# Altium schematic sheet LC BigOne - 5.3A MOSFET for TLC5940 3.SchDoc: DBL TLC5940 driver for High load - 5.3A MOSFET
size A4; Revision: 0; SheetNumber: 2; SheetTotal: 2; Version: 1.0; Variant: 5.3 A MOSFET; Modification: Mod; Project: Light Control
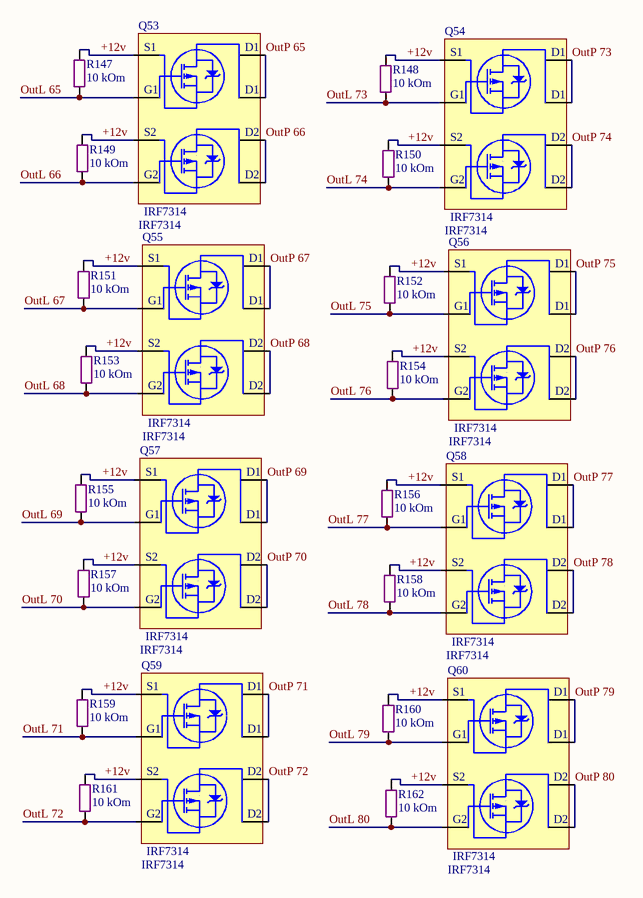
[diagram p0: LC BigOne - 5.3A MOSFET for TLC5940 3.SchDoc]

## Parts
Q53  IRF7314  [SO8]
Q54  IRF7314  [SO8]
Q55  IRF7314  [SO8]
Q56  IRF7314  [SO8]
Q57  IRF7314  [SO8]
Q58  IRF7314  [SO8]
Q59  IRF7314  [SO8]
Q60  IRF7314  [SO8]
R147  10 kOm  [SMD 0805 (2012)]
R148  10 kOm  [SMD 0805 (2012)]
R149  10 kOm  [SMD 0805 (2012)]
R150  10 kOm  [SMD 0805 (2012)]
R151  10 kOm  [SMD 0805 (2012)]
R152  10 kOm  [SMD 0805 (2012)]
R153  10 kOm  [SMD 0805 (2012)]
R154  10 kOm  [SMD 0805 (2012)]
R155  10 kOm  [SMD 0805 (2012)]
R156  10 kOm  [SMD 0805 (2012)]
R157  10 kOm  [SMD 0805 (2012)]
R158  10 kOm  [SMD 0805 (2012)]
R159  10 kOm  [SMD 0805 (2012)]
R160  10 kOm  [SMD 0805 (2012)]
R161  10 kOm  [SMD 0805 (2012)]
R162  10 kOm  [SMD 0805 (2012)]

## Nets
+12v: Q53.1(S) Q53.3(S) Q54.1(S) Q54.3(S) Q55.1(S) Q55.3(S) Q56.1(S) Q56.3(S) Q57.1(S) Q57.3(S) Q58.1(S) Q58.3(S) Q59.1(S) Q59.3(S) Q60.1(S) Q60.3(S) R147.2 R148.2 R149.2 R150.2 R151.2 R152.2 R153.2 R154.2 R155.2 R156.2 R157.2 R158.2 R159.2 R160.2 R161.2 R162.2
OutL 65: Q53.2(G) R147.1
OutL 66: Q53.4(G) R149.1
OutL 67: Q55.2(G) R151.1
OutL 68: Q55.4(G) R153.1
OutL 69: Q57.2(G) R155.1
OutL 70: Q57.4(G) R157.1
OutL 71: Q59.2(G) R159.1
OutL 72: Q59.4(G) R161.1
OutL 73: Q54.2(G) R148.1
OutL 74: Q54.4(G) R150.1
OutL 75: Q56.2(G) R152.1
OutL 76: Q56.4(G) R154.1
OutL 77: Q58.2(G) R156.1
OutL 78: Q58.4(G) R158.1
OutL 79: Q60.2(G) R160.1
OutL 80: Q60.4(G) R162.1
OutP 65: Q53.7(D) Q53.8(D)
OutP 66: Q53.5(D) Q53.6(D)
OutP 67: Q55.7(D) Q55.8(D)
OutP 68: Q55.5(D) Q55.6(D)
OutP 69: Q57.7(D) Q57.8(D)
OutP 70: Q57.5(D) Q57.6(D)
OutP 71: Q59.7(D) Q59.8(D)
OutP 72: Q59.5(D) Q59.6(D)
OutP 73: Q54.7(D) Q54.8(D)
OutP 74: Q54.5(D) Q54.6(D)
OutP 75: Q56.7(D) Q56.8(D)
OutP 76: Q56.5(D) Q56.6(D)
OutP 77: Q58.7(D) Q58.8(D)
OutP 78: Q58.5(D) Q58.6(D)
OutP 79: Q60.7(D) Q60.8(D)
OutP 80: Q60.5(D) Q60.6(D)

## Notes on the sheet
- Ver:
- Rev:
- Sheet
- of
- File:
- (in symbol IRF7314) S1; D1; G1; S2; D2; G2

## Library data of the parts
Q53-Q60 = IRF7314: Dual P-Ch  20V - 0.058Ω - 5.3A; Monufacturer: IOR; RDS Сопротивление Сток-Исток: 0.058 Om; I d - Drain current (continuous) at TC = 100°C: 4.3 A; VGS Порог Открытия: -0.7 V; VGS Макс напр на гейте: +-12 V; C ISS Входная емкость: 780 pF; C OSS Выходная емкость: 470 pF; V DSS (v): 20V; I d - Drain current (continuous) at TC = 25°C: 5.3 A; Name: IRF7314; Datasheet: http://tec.org.ru/_bd/2/277_IRF7314-IR.pdf; URL: http://tec.org.ru/board/49-1-0-277
R147-R162 = Res All Types